# EAGLE design Shield_RTC_MCP7940N (EAGLE 9.4.0)
COMPANY: Unexpected Maker; DATE: 24-10-2018; DRAWN: Seon; REV: V1; TITLE: TinyPICO
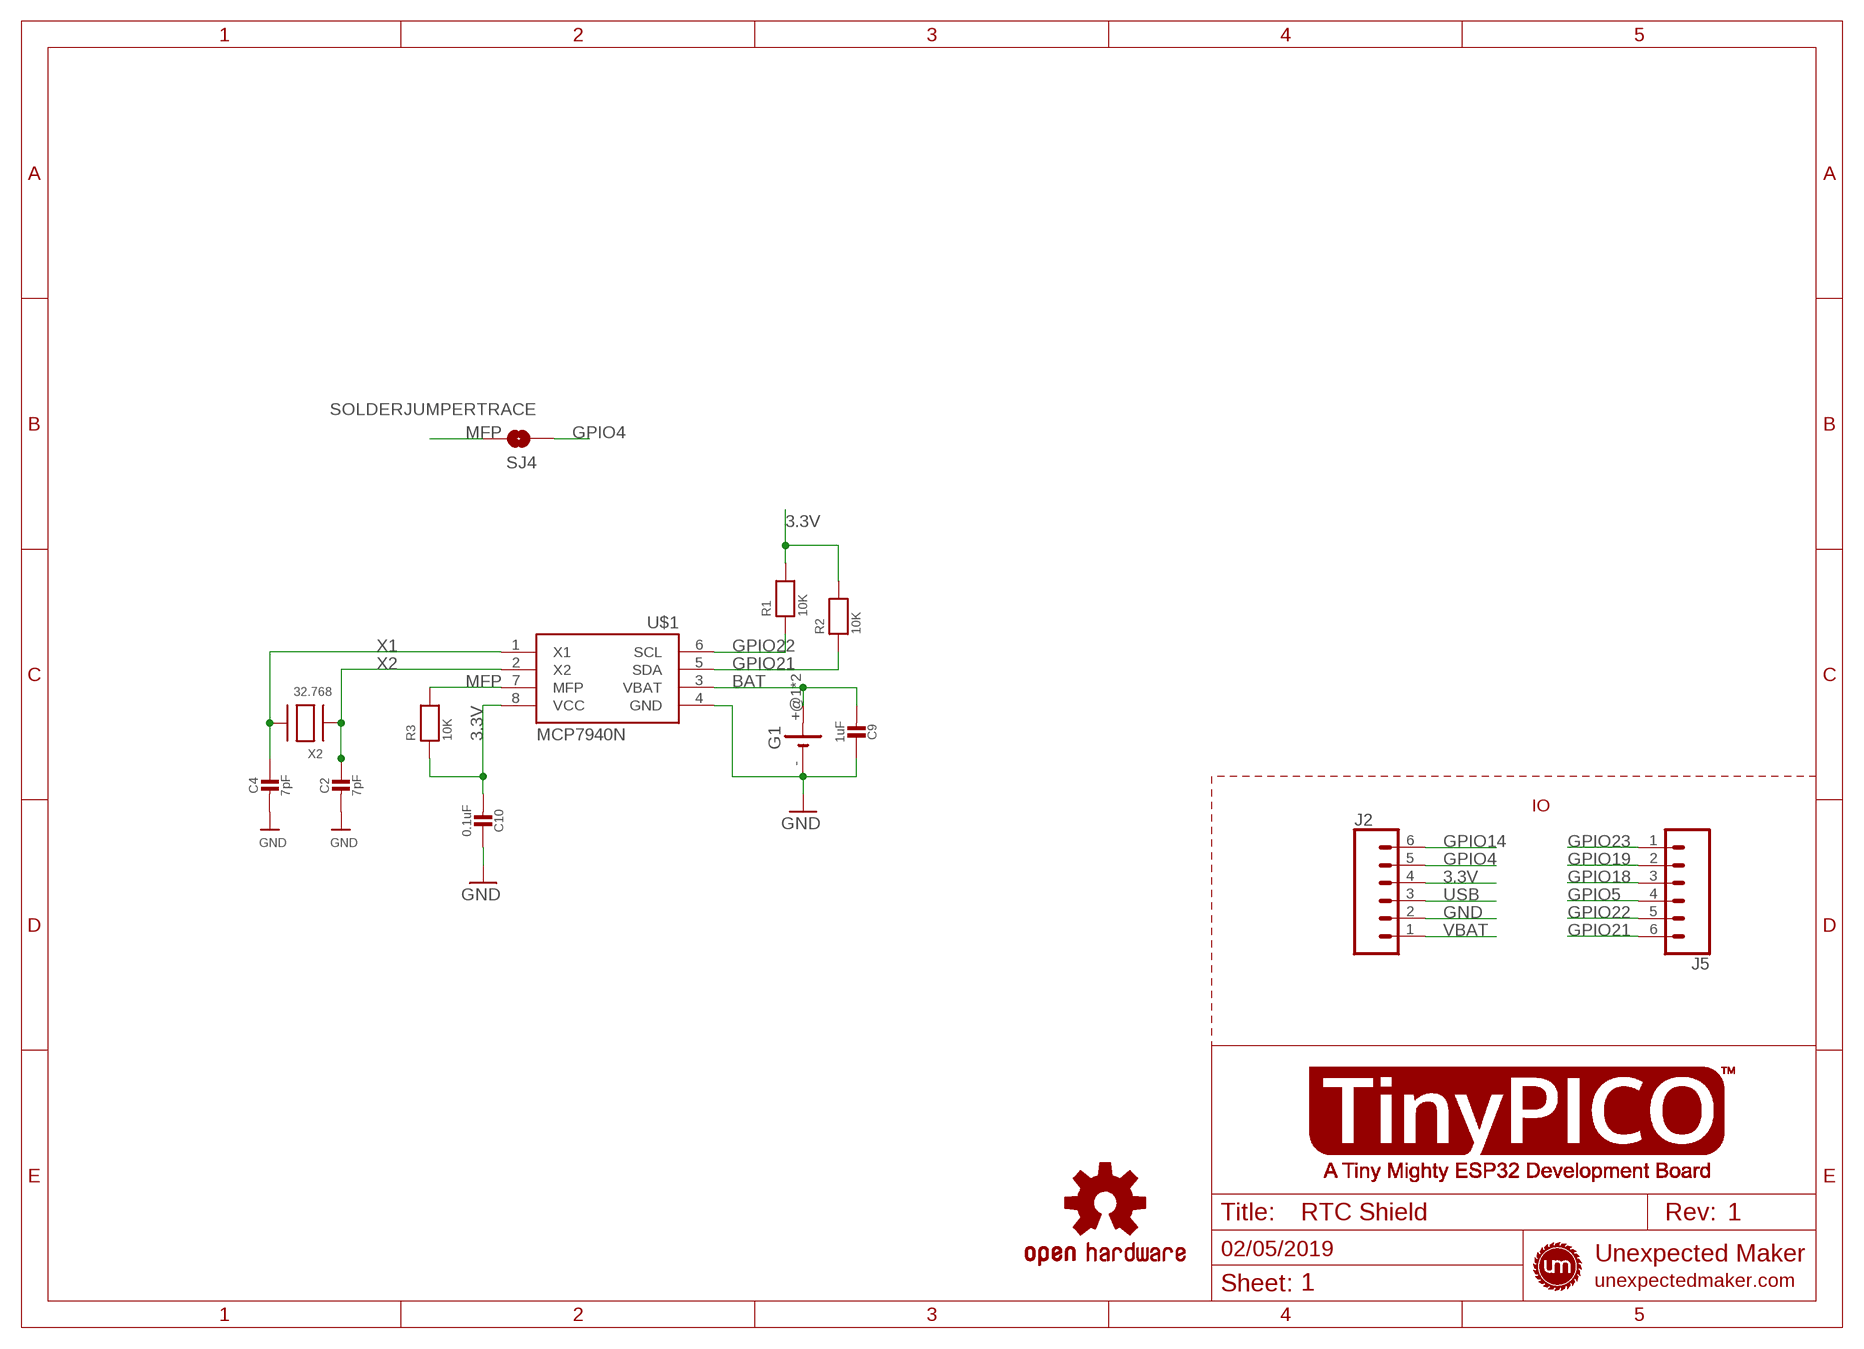
[diagram p0: schematic, sheet 1]
FRAME2 (FRAME_A4_TINYPICO): CDATE: 02/05/2019; REV: 1; SHEET_NUM: 1; TITLE: RTC Shield

## Parts
C2  7pF  CAP_CERAMIC_0603MP  [_0603MP]
C4  7pF  CAP_CERAMIC_0603MP  [_0603MP]
C9  1uF  CAP_CERAMIC_0603MP  [_0603MP]
C10  0.1uF  CAP_CERAMIC_0603MP  [_0603MP]
G1  10MM_SM_COIN_CELL_CLIP  [10MM_SM_COIN_CELL_CLIP]
J2  CONN_06NO_SILK_FEMALE_PTH  [1X06_NO_SILK]
J5  CONN_06NO_SILK_FEMALE_PTH  [1X06_NO_SILK]
LOGO1  OSHW-LOGOS  [OSHW-LOGO-S]
R1  10K  RESISTOR_0603MP  [_0603MP]
R2  10K  RESISTOR_0603MP  [_0603MP]
R3  10K  RESISTOR_0603MP  [_0603MP]
SJ4  SOLDERJUMPERTRACE  [SPARKFUN_SJ_2S-TRACE]
U$1  MCP7940N  [SOIC8_150MIL]
X2  32.768  XTAL-3.2X1.5  [XTAL3215]

## Nets
3.3V: C10.2 J2.4 R1.2 R2.2 R3.1 U$1.8(VCC)
BAT: C9.2 G1.+@1(+) G1.+@2(+) U$1.3(VBAT)
GND: C2.2 C4.2 C9.1 C10.1 G1.- J2.2 U$1.4(GND)
GPIO4: J2.5 SJ4.1
GPIO5: J5.4
GPIO14: J2.6
GPIO18: J5.3
GPIO19: J5.2
GPIO21: J5.6 R2.1 U$1.5(SDA)
GPIO22: J5.5 R1.1 U$1.6(SCL)
GPIO23: J5.1
MFP: R3.2 SJ4.2 U$1.7(MFP)
USB: J2.3
VBAT: J2.1
X1: C4.1 U$1.1(X1) X2.P$2
X2: C2.1 U$1.2(X2) X2.P$1

## Notes on the sheet
- IO

## Library data of the parts
C2 C4 C9 C10 = microbuilder:CAP_CERAMIC: Ceramic Capacitors For new designs, use the packages preceded by an '_' character since they are more reliable: The following footprints should be used on most boards: _0402 - Standard footprint for regular board layouts _0603 - Standard footprint for regular board layouts _0805 - Standard footprint for regular board layouts _1206 - Standard footprint for regular board layouts For extremely tight-pitch boards where space is at a premium, the following 'micro-pitch' footprints can be used (smaller pads, no silkscreen outline, etc.): _0402MP - Micro-pitch footprint for very dense/compact boards _0603MP - Micro-pitch footprint for very dense/compact boards _0805MP - Micro-pitch footprint for very dense/compact boards _1206MP - Micro-pitch footprint for very dense/compact boards
G1 = battery:10MM_SM_COIN_CELL_CLIP: Battery cell clip for CR927 Source: KEYSTONE ELECTRONICS CORP. www.keyelco.com, ASTORIA, N.Y. 11105-2017 PART ANME 10mm SM COIN CELl CLIP DWG NO. 3030
J2 J5 = SparkFun-Connectors:CONN_06: Multi connection point. Often used as Generic Header-pin footprint for 0.1 inch spaced/style header connections On any of the 0.1 inch spaced packages, you can populate with these: Break Away Headers - Straight <https://www.sparkfun.com/products/116> (PRT-00116) Break Away Male Headers - Right Angle <https://www.sparkfun.com/products/553> (PRT-00553) Female Headers <https://www.sparkfun.com/products/115> (PRT-00115) Break Away Headers - Machine Pin <https://www.sparkfun.com/products/117> (PRT-00117) Break Away Female Headers - Swiss Machine Pin <https://www.sparkfun.com/products/743> (PRT-00743) Arduino Stackable Header - 6 Pin <https://www.sparkfun.com/products/9280> (PRT-09280) For SCREWTERMINALS and SPRING TERMINALS visit here: Screw Terimnals on SparkFun.com <https://www.sparkfun.com/search/results?term=Screw+Terminals> (5mm/3.5mm/2.54mm spacing) This device is also useful as a general connection point to wire up your design to another part of your project. Our various solder wires solder well into these plated through hole pads. Hook-Up Wire - Assortment (Stranded, 22 AWG) <https://www.sparkfun.com/products/11375> (PRT-11375) Hook-Up Wire - Assortment (Solid Core, 22 AWG) <https://www.sparkfun.com/products/11367> (PRT-11367) View the entire wire category on our website here <https://www.sparkfun.com/categories/141>; PROD_ID: CONN-08437
LOGO1 = SparkFun-Aesthetics:OSHW-LOGO: Open-Source Hardware (OSHW) Logo This logo indicates the piece of hardware it is found on incorporates a OSHW license and/or adheres to the definition of open source hardware found here: http://freedomdefined.org/OSHW
R1-R3 = microbuilder:RESISTOR: Resistors 0402 - 0402 Surface Mount Package 22 Ohm 1% 1/16W [Digikey: 311-22.0LRTR-ND] 33 Ohm 5% 1/16W 1.0K 5% 1/16W 1.5K 5% 1/16W 2.0K 1% 1/16W 10.0K 1% 1/16W [Digikey: 311-10.0KLRTR-ND] 10.0K 5% 1/16W [Digikey: RMCF0402JT10K0TR-ND] 12.1K 1% 1/16W [Digikey: 311-22.0LRTR-ND] 100.0K 5% 1/16W 0603 - 0603 Surface Mount Package 0 Ohm 1/10 Watt 1% Resistor 15 Ohm 1/10 Watt 1% Resistor 33 Ohm 1/10 Watt 1% Resistor 49.9 Ohm 1/10 Watt 1% Resistor 100 Ohm 1/10 Watt 1% Resistor 150 Ohm 1/10 Watt 1% Resistor 240 Ohm 1/10 Watt 1% Resistor 390 Ohm 1/10 Watt 1% Resistor 560 Ohm 1/10 Watt 1% Resistor 680 Ohm 1/10 Watt 1% Resistor 750 Ohm 1/10 Watt 1% Resistor 1.0K Ohm 1/10 Watt 1% Resistor 1.5K Ohm 1/10 Watt 1% Resistor 2.0K Ohm 1/10 Watt 1% Resistor 2.2K Ohm 1/10 Watt 1% Resistor 3.3K Ohm 1/10 Watt 1% Resistor 4.7K Ohm 1/10 Watt 1% Resistor 10.0K Ohm 1/10 Watt 1% Resistor 12.0K Ohm 1/10 Watt 1% Resistor 12.1K Ohm 1/10 Watt 1% Resistor 20.0K Ohm 1/10 Watt 1% Resistor 33.0K Ohm 1/10 Watt 1% Resistor 100.0K Ohm 1/10 Watt 1% Resistor 0805 - 0805 Surface Mount Package 0 Ohm 1/8 Watt 1% Resistor 33 Ohm 1/8 Watt 1% Resistor 100 Ohm 1/8 Watt 1% Resistor 150 Ohm 1/8 Watt 1% Resistor 200 Ohm 1/8 Watt 1% Resistor 240 Ohm 1/8 Watt 1% Resistor 330 Ohm 1/8 Watt 1% Resistor 390 Ohm 1/8 Watt 1% Resistor 470 Ohm 1/8 Watt 1% Resistor 1.0K Ohm 1/8 Watt 1% Resistor 1.5K Ohm 1/8 Watt 1% Resistor 2.0K Ohm 1/8 Watt 1% Resistor 4.7K Ohm 1/8 Watt 1% Resistor 5.1K Ohm 1/8 Watt 1% Resistor 5.6K Ohm 1/8 Watt 1% Resistor 10.0K Ohm 1/8 Watt 1% Resistor 22.0K Ohm 1/8 Watt 1% Resistor 33.0K Ohm 1/8 Watt 1% Resistor 100K Ohm 1/8 Watt 1% Resistor 1206 - 1206 Surface Mount Package 2012 - 2010 Surface Mount Package 0.11 Ohm 1/2 Watt 1% Resistor - Digikey: RHM.11UCT-ND
SJ4 = UnexpectedMaker:SOLDERJUMPER: Solder Jumper Standard SMD solder jumper. Used to automate production. Two varients : Normally Open and Normally Closed are the same, but have different paste layers. NC will have a large amount of paste and should jumper during reflow.
U$1 = UnexpectedMaker:MCP7940N
X2 = adafruit2:XTAL: Low cost SMT crystals, no capacitors included http://www.ladyada.net/library/eagle

## Board
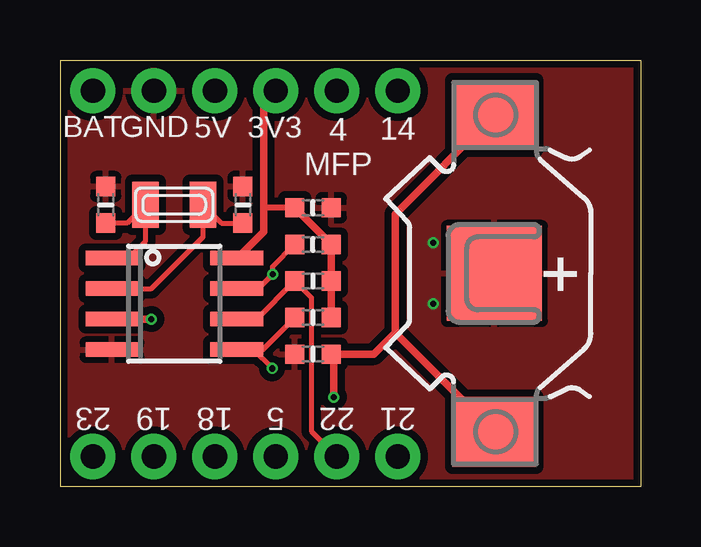
[diagram p1: board, top side]
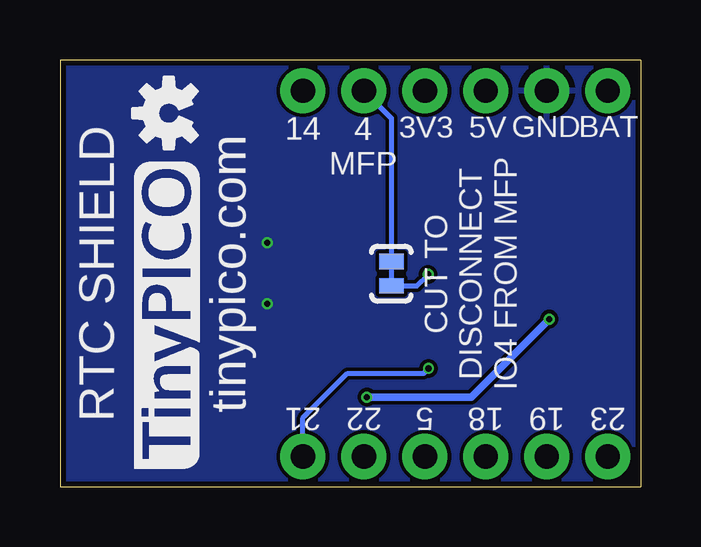
[diagram p2: board, bottom side, seen from below]

Size 24.19 x 17.78 mm. Coordinates in mm from the lower left corner, seen from the top.
Outline: 24.19,0 0,0 0,17.78 24.19,17.78 24.19,0
Copper layers (1*16): Top 0.035mm / dielectric 1.5mm / Bottom 0.035mm
Design rules "UnexpectedMaker_JLCPCB 2 Layer": minimum track width 6mil, minimum drill 10mil, track to track 6mil, track to pad 6mil, pad to pad 6mil, via to via 6mil, smd to smd 6mil, copper to edge 9mil, drill to drill 7mil, minimum pad ring 4mil, minimum via ring 4mil, stop-mask expansion 4mil, vias tented up to drill 25mil, thermal gap 10mil

### Footprints (pad centres in the part's own frame; a part is rotated, then mirrored left to right if it is on the bottom)
_0603MP = smd 0.8 x 0.8: 1 -0.762,0; 2 0.762,0
10MM_SM_COIN_CELL_CLIP = smd 2.9 x 3.5: +@1 -6.6,0; +@2 6.6,0 | smd 3.96 x 3.96: - 0,0
1X06_NO_SILK = drill 1.016 pad 1.88: 1 0,0; 2 2.54,0; 3 5.08,0; 4 7.62,0; 5 10.16,0; 6 12.7,0
SPARKFUN_SJ_2S-TRACE = smd 0.635 x 1.016: 1 -0.508,0; 2 0.508,0
SOIC8_150MIL = smd 0.6 x 2.2: 1 -1.905,-2.6; 2 -0.635,-2.6; 3 0.635,-2.6; 4 1.905,-2.6; 5 1.905,2.6; 6 0.635,2.6; 7 -0.635,2.6; 8 -1.905,2.6
XTAL3215 = smd 1.1 x 1.9: P$1 1.2,0; P$2 -1.2,0

### Placement (x,y rotation side)
C2  7.62,11.75 90 top
C4  1.91,11.75 90 top
C9  10.54,5.52 0 top
C10  10.54,11.62 180 top
G1  18.1,8.89 270 top
J2  1.37,16.5 0 top
J5  1.37,1.26 0 top
LOGO1  19.67,15.56 90 bottom
R1  10.54,8.57 0 top
R2  10.54,7.05 0 top
R3  10.54,10.1 180 top
SJ4  10.39,8.88 270 bottom
U$1  4.76,7.62 270 top
X2  4.76,11.75 0 top

### Tracks (layer width: path | path; a pad name or v marks a point on that pad's centre or on a via)
3.3V
  Top 0.254: C10.2 8.5,11.62 8.48,11.61 | U$1.8 8.48,10.65 8.48,11.75
  Top 0.305: R2.2 R1.2 R3.1 C10.2 | J2.4 8.48,15.99 8.48,11.75 8.48,11.61 8.48,10.62 7.39,9.53 U$1.8
BAT  (via drill 0.25)
  Top 0.305: G1.+@1 13.97,11.36 13.97,6.42 | 13.97,6.42 G1.+@2 | v11.4,3.73 11.4,5.58 C9.2 13.08,5.52 13.97,6.42 | v3.81,6.99 U$1.3
  Bottom 0.305: v11.4,3.73 7.06,3.73 v3.81,6.99
GND  (via drill 0.25)
  other vias: 15.56,10.16 15.56,7.62
  pour Top (isolate 0.305): -0.85,18.1 -0.85,-0.33 24.55,-0.33 24.55,18.08 -0.84,18.08
  pour Bottom: 25.08,18.41 25.08,-0.64 -1.27,-0.64 -1.27,18.41
GPIO4
  Bottom 0.203: SJ4.1 10.39,15.35 J2.5
GPIO21  (via drill 0.25)
  Top 0.203: 8.05,5.71 8.45,5.71 R2.1 | v8.84,4.93 8.05,5.71 | 8.05,5.71 U$1.5
  Bottom 0.203: v8.84,4.93 9.04,4.72 12.22,4.72 14.07,2.87 J5.6
GPIO22
  Top 0.203: J5.5 10.48,2.31 10.48,7.87 R1.1 8.19,6.99 U$1.6
MFP  (via drill 0.25)
  Top 0.203: U$1.7 8.27,8.26 v8.86,8.85 8.86,9.18 R3.2
  Bottom 0.203: v8.86,8.85 8.86,8.84 9.33,8.37 SJ4.2
X1
  Top 0.203: U$1.1 2.86,9.53 3.56,10.23 X2.P$2 2.8,10.99 C4.1
X2
  Top 0.203: U$1.2 3.81,8.26 5.96,10.41 X2.P$1 6.72,10.99 C2.1

### Text on the board
bPlace: tinypico.com | RTC SHIELD
tNames: BAT | GND | 5V | 3V3 | 14 | 4 / MFP | 23 | 19 | 18 | 5 | 22 | 21
bNames: BAT | GND | 5V | 3V3 | 14 | 4 / MFP | CUT TO / DISCONNECT / IO4 FROM MFP | 23 | 19 | 18 | 5 | 22 | 21